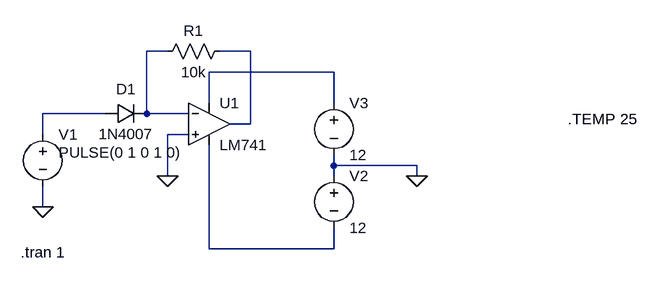
[diagram p0: schematic antiLogDiode.asc]
antiLogDiode.asc, the LTspice schematic file:
Version 4
SHEET 1 880 680
WIRE 128 -144 96 -144
WIRE 256 -144 208 -144
WIRE 384 -112 192 -112
WIRE 192 -64 192 -112
WIRE 384 -64 384 -112
WIRE 32 -48 -64 -48
WIRE 96 -48 96 -144
WIRE 160 -48 96 -48
WIRE 256 -32 256 -144
WIRE 256 -32 224 -32
WIRE -64 -16 -64 -48
WIRE 160 -16 128 -16
WIRE 384 32 384 16
WIRE 512 32 384 32
WIRE 128 48 128 -16
WIRE 384 48 384 32
WIRE 512 48 512 32
WIRE -64 96 -64 64
WIRE 192 160 192 0
WIRE 384 160 384 128
WIRE 384 160 192 160
FLAG -64 96 0
FLAG 512 48 0
FLAG 128 48 0
SYMBOL diode 32 -32 R270
WINDOW 0 38 32 VTop 2
WINDOW 3 0 32 VBottom 2
SYMATTR InstName D1
SYMATTR Value 1N4007
SYMBOL voltage -64 -32 R0
WINDOW 3 24 44 Left 2
WINDOW 123 0 0 Left 0
WINDOW 39 0 0 Left 0
SYMATTR InstName V1
SYMATTR Value PULSE(0 1 0 1 0)
SYMBOL voltage 384 32 R0
WINDOW 123 0 0 Left 0
WINDOW 39 0 0 Left 0
SYMATTR InstName V2
SYMATTR Value 12
SYMBOL voltage 384 -80 R0
WINDOW 123 0 0 Left 0
WINDOW 39 0 0 Left 0
SYMATTR InstName V3
SYMATTR Value 12
SYMBOL OpAmps\\LM741 192 -96 R0
SYMATTR InstName U1
SYMBOL res 224 -160 R90
WINDOW 0 0 56 VBottom 2
WINDOW 3 32 56 VTop 2
SYMATTR InstName R1
SYMATTR Value 10k
TEXT -98 166 Left 2 !.tran 1
TEXT 744 -40 Left 2 !.TEMP 25

The netlist it stands for:
* antiLogDiode.asc
D1 N004 N001 1N4007
V1 N004 0 PULSE(0 1 0 1 0)
V2 0 N005 12
V3 N003 0 12
XU1 0 N001 N003 N005 N002 LM741  ; pins In+ In- V+ V- OUT
R1 N002 N001 10k
.model D D
.lib standard.dio
.tran 1
.TEMP 25
.lib LM741.lib
.backanno
.end